# Altium schematic sheet USART_IrDA.SchDoc: USART_IrDA
size A3; DocumentNumber: MB1144; Revision: C-02; SheetNumber: 9; SheetTotal: 25; Project: STM32L476G-EVAL; ModifiedDate: 9/23/2015
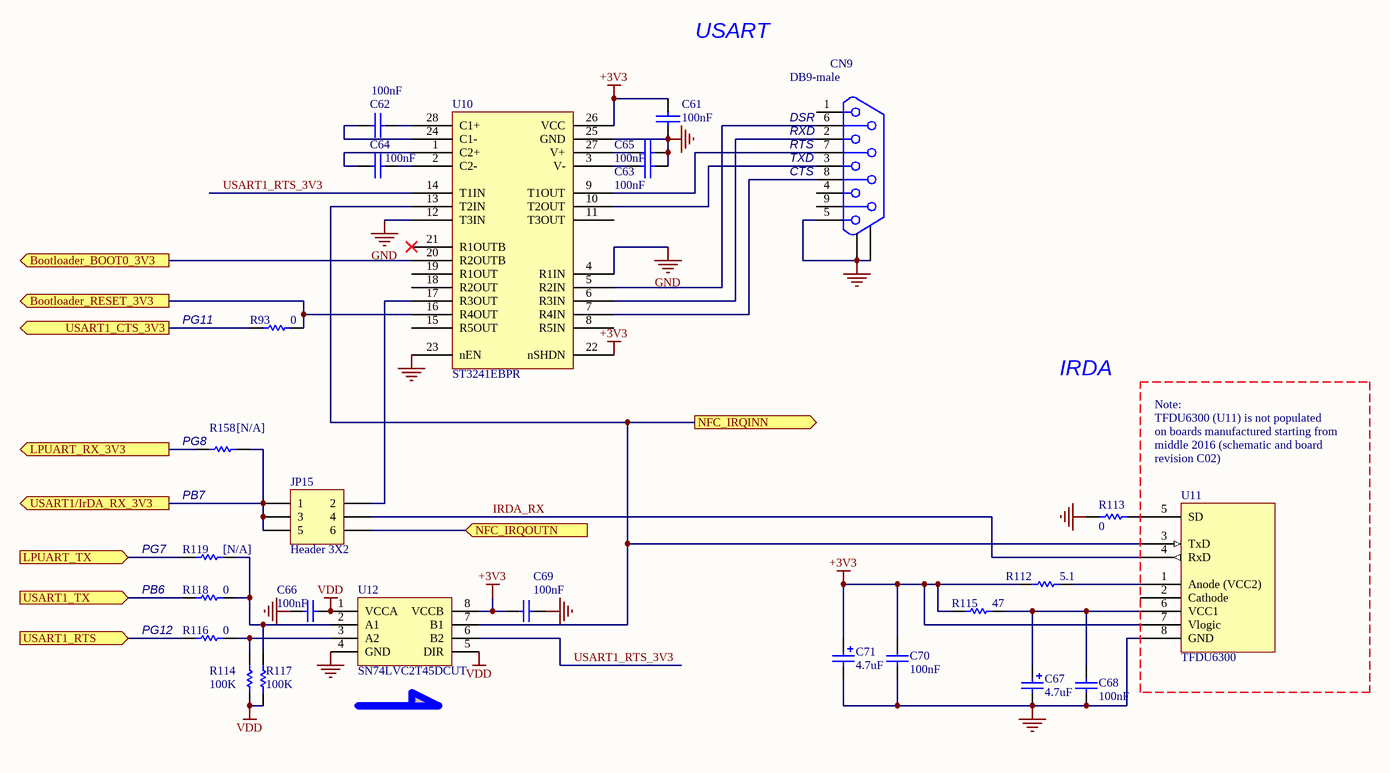
[diagram p0: USART_IrDA.SchDoc]

## Parts
C61  100nF  [0402C]
C62  100nF  [0402C]
C63  100nF  [0402C]
C64  100nF  [0402C]
C65  100nF  [0402C]
C66  100nF  [0402C]
C67  4.7uF  [TAN-A]
C68  100nF  [0402C]
C69  100nF  [0402C]
C70  100nF  [0402C]
C71  4.7uF  [TAN-A]
CN9  DB9-male  [DB9/M]
JP15  Header 3X2  [HDR_2X3_2R54]
R93  0  [0603R]
R112  5.1  [0402R]
R113  0  [0603R]
R114  100K  [0402R]
R115  47  [0402R]
R116  0  [0603R]
R117  100K  [0402R]
R118  0  [0603R]
R119  [N/A]  [0603R]
R158  [N/A]  [0603R]
U10  ST3241EBPR  [SSOP28_0R65_10R2X7R8]
U11  TFDU6300  [IR_VISHAY3]
U12  SN74LVC2T45DCUT  [USOP8_0R5_2X3R1]

## Ports
Bootloader_BOOT0_3V3 (out), Bootloader_RESET_3V3 (out), LPUART_RX_3V3 (out), LPUART_TX (in), NFC_IRQINN (out), NFC_IRQOUTN (in), USART1/IrDA_RX_3V3 (out), USART1_CTS_3V3 (out), USART1_RTS (in), USART1_TX (in)

## Nets
+3V3: C61.2 C69.2 C70.2 C71.1 R112.1 R115.1 U10.22(nSHDN) U10.26(VCC) U11.7(Vlogic) U12.8(VCCB)
GND: C61.1 C63.2 C65.2 C66.1 C67.2 C68.1 C69.1 C70.1 C71.2 CN9.5 CN9.10 CN9.11 R113.2 U10.4(R1IN) U10.12(T3IN) U10.23(nEN) U10.25(GND) U11.8(GND) U12.4(GND)
VDD: C66.2 R114.2 R117.2 U12.1(VCCA) U12.5(DIR)
Bootloader_BOOT0_3V3: U10.20(R2OUTB) ; port Bootloader_BOOT0_3V3
Bootloader_RESET_3V3: R93.1 U10.16(R4OUT) ; port Bootloader_RESET_3V3
IRDA_RX: JP15.4 U11.4(RxD)
LPUART_RX_3V3: R158.2 ; port LPUART_RX_3V3
LPUART_TX: R119.2 ; port LPUART_TX
NFC_IRQINN: U10.13(T2IN) U11.3(TxD) U12.7(B1) ; port NFC_IRQINN
NFC_IRQOUTN: JP15.6 ; port NFC_IRQOUTN
USART1/IrDA_RX_3V3: JP15.1 JP15.3 JP15.5 R158.1 ; port USART1/IrDA_RX_3V3
USART1_CTS_3V3: R93.2 ; port USART1_CTS_3V3
USART1_RTS: R116.2 ; port USART1_RTS
USART1_RTS_3V3: U10.14(T1IN) U12.6(B2)
USART1_TX: R118.2 ; port USART1_TX
NetC62_1: C62.1 U10.24(C1-)
NetC62_2: C62.2 U10.28(C1+)
NetC63_1: C63.1 U10.3(V-)
NetC64_1: C64.1 U10.1(C2+)
NetC64_2: C64.2 U10.2(C2-)
NetC65_1: C65.1 U10.27(V+)
NetC67_1: C67.1 C68.2 R115.2 U11.6(VCC1)
NetCN9_2: CN9.2 U10.6(R3IN)
NetCN9_3: CN9.3 U10.10(T2OUT)
NetCN9_6: CN9.6 U10.5(R2IN)
NetCN9_7: CN9.7 U10.9(T1OUT)
NetCN9_8: CN9.8 U10.7(R4IN)
NetJP15_2: JP15.2 U10.17(R3OUT)
NetR112_2: R112.2 U11.1(Anode_(VCC2))
NetR113_1: R113.1 U11.5(SD)
NetR114_1: R114.1 R116.1 U12.3(A2)
NetR117_1: R117.1 R118.1 R119.1 U12.2(A1)

Not connected (* = marked no-connect by the designer): CN9 1 4 9; U10 8(R5IN) 11(T3OUT) 15(R5OUT) 18(R2OUT) 19(R1OUT) 21(R1OUTB)*; U11 2(Cathode)

## Notes on the sheet
- USART
- (near CN9) RXD
- (near CN9) RTS
- (near CN9) TXD
- (near CN9) DSR
- (near CN9) CTS
- PG11
- IRDA
- PB7
- (near R158) PG8
- Note:
  TFDU6300 (U11) is not populated
  on boards manufactured starting from
  middle 2016 (schematic and board revision C02)
- PG7
- PG12
- PB6
- Title:
- Project:
- Size:
- Date:
- A3
- Reference:
- Sheet:
- Revision:
- of

## Library data of the parts
C61-C65 = CAP: Capacitor; Ordered by: Subcon; ECCN_US/EU: NA
C66 C68-C70 = CAP: Capacitor; Value: 100pF; Ordered by: Subcon; ECCN_US/EU: NA; Published: 8-Jun-2000; Revision: July-2002: Re-released for DXP Platform.; Publisher: Altium Limited
C67 C71 = Cap Pol1: Polarized Capacitor (Radial); Value: 100pF; Ordered by: Subcon; ECCN_US/EU: NA; Published: 8-Jun-2000; Revision: July-2002: Re-released for DXP Platform.; Publisher: Altium Limited
CN9 = DB9: Ordered by: Subcon; Comments: DB9 USART; ECCN_US/EU: NA
JP15 = Header 3X2: Header, 3-Pin, Dual row; ECCN_US/EU: NA; Ordered by: Subcon; Revision: 17-Jul-2002: Re-released for DXP Platform.; Publisher: Altium Limited
R93 R112-R118 = Res1: Resistor; Value: 1K; Ordered by: Subcon; ECCN_US/EU: NA; Published: 8-Jun-2000; Revision: July-2002: Re-released for DXP Platform.; Publisher: Altium Limited
R119 R158 = Res1: Resistor; Value: 1K; Ordered by: Subcon; ECCN_US/EU: NA; Fitted: NO; Published: 8-Jun-2000; Revision: July-2002: Re-released for DXP Platform.; Publisher: Altium Limited
U10 = ST3241: Ordered by: ST; ECCN_US/EU: EAR99/NEC; Ref St: 9176312; Manuf_1: ST; Manuf_Part_1: ST3241EBPR
U11 = TFDU4300: Manuf_1: Vishay; Ordered by: Subcon; ECCN_US/EU: EAR99/NEC; Fitted or not fitted: NO; Manuf_Part_1: TFDU6300
U12 = SN74LVC2T45DCUT: Manuf_1: TI; Ordered by: Subcon; ECCN_US/EU: EAR99/NEC; Manuf_Part_1: SN74LVC2T45DCUT